# Altium schematic sheet Uav_V1.SchDoc: UAV Kommunikation PCB
size A3; DrawnBy: Andreas Albisser; Organization: HSLU T&A; Address1: Abteilung Elektrotechnik; Address2: Technikumsstrasse 21; Address3: CH-6048 Horw; Revision: 1; SheetNumber: 1; SheetTotal: 1; Projektname: UAV Inspektion; PageSetup: Record=PageOptions|CenterHorizontal=True|CenterVertical=True|PrintScale=0.73|XCorrection=1.00|YCorrection=1.00|PrintKind=0|BorderSize=5000000|LeftOffset=0|BottomOffset=0|Orientation=2|PaperLength=1000|PaperWidth=1000|Scale=100|PaperSource=7|PrintQuality=-3|MediaType=1|DitherType=10|PrintScaleMode=1|PaperKind=A4|PaperIndex=9
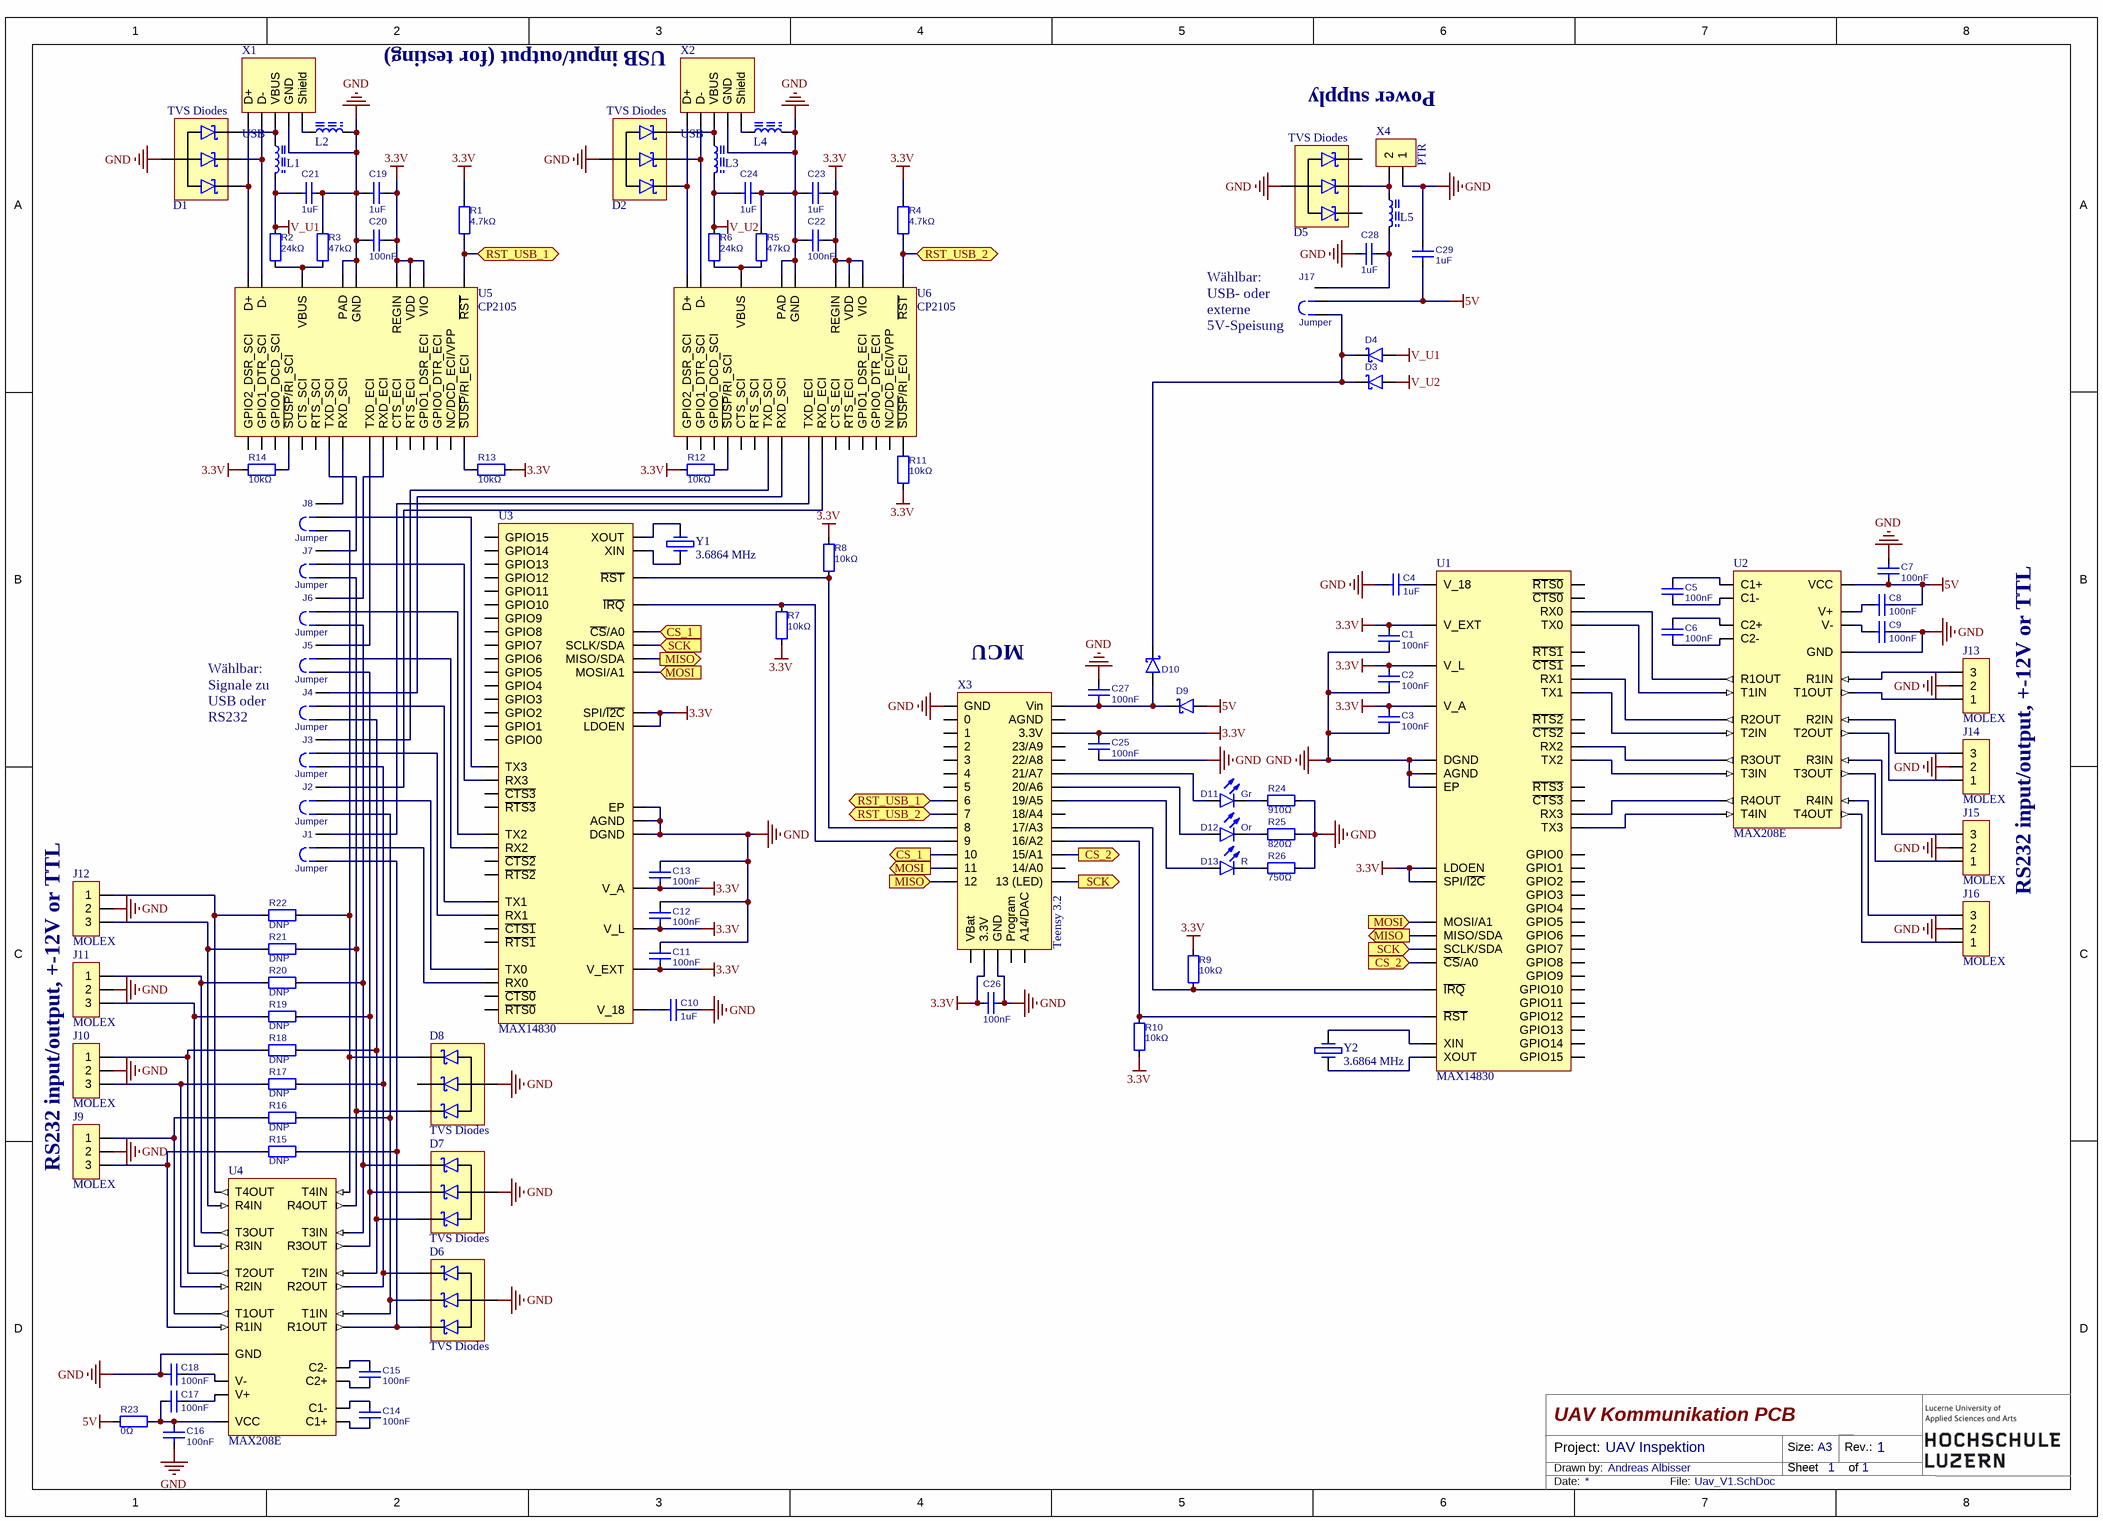
[diagram p0: Uav_V1.SchDoc]

## Parts
C1  100nF  [0603]
C2  100nF  [0603]
C3  100nF  [0603]
C4  1uF  [0603]
C5  100nF  [0603]
C6  100nF  [0603]
C7  100nF  [0603]
C8  100nF  [0603]
C9  100nF  [0603]
C10  1uF  [0603]
C11  100nF  [0603]
C12  100nF  [0603]
C13  100nF  [0603]
C14  100nF  [0603]
C15  100nF  [0603]
C16  100nF  [0603]
C17  100nF  [0603]
C18  100nF  [0603]
C19  1uF  [0603]
C20  100nF  [0603]
C21  1uF  [0603]
C22  100nF  [0603]
C23  1uF  [0603]
C24  1uF  [0603]
C25  100nF  [0603]
C26  100nF  [0603]
C27  100nF  [0603]
C28  1uF  [0603]
C29  1uF  [0603]
D1  TVS Diodes  [SOT-143-4]
D2  TVS Diodes  [SOT-143-4]
D3  ?  [SOD-123]  (value not drawn)
D4  ?  [SOD-123]  (value not drawn)
D5  TVS Diodes  [SOT-143-4]
D6  TVS Diodes  [SOT-143-4]
D7  TVS Diodes  [SOT-143-4]
D8  TVS Diodes  [SOT-143-4]
D9  ?  [SOD-123]  (value not drawn)
D10  ?  [SOD-123]  (value not drawn)
D11  Gr  [0603D]
D12  Or  [0603D]
D13  R  [0603D]
J1  Jumper  [Header2,54mm_1x3]
J2  Jumper  [Header2,54mm_1x3]
J3  Jumper  [Header2,54mm_1x3]
J4  Jumper  [Header2,54mm_1x3]
J5  Jumper  [Header2,54mm_1x3]
J6  Jumper  [Header2,54mm_1x3]
J7  Jumper  [Header2,54mm_1x3]
J8  Jumper  [Header2,54mm_1x3]
J9  MOLEX  [MOLEX_1x3]
J10  MOLEX  [MOLEX_1x3]
J11  MOLEX  [MOLEX_1x3]
J12  MOLEX  [MOLEX_1x3]
J13  MOLEX  [MOLEX_1x3]
J14  MOLEX  [MOLEX_1x3]
J15  MOLEX  [MOLEX_1x3]
J16  MOLEX  [MOLEX_1x3]
J17  Jumper  [Header2,54mm_1x3]
L1  MPZ1608S601A  [0603]  (value not drawn)
L2  MPZ1608S601A  [0603]  (value not drawn)
L3  MPZ1608S601A  [0603]  (value not drawn)
L4  MPZ1608S601A  [0603]  (value not drawn)
L5  MPZ1608S601A  [0603]  (value not drawn)
R1  4.7kΩ  [0603]
R2  24kΩ  [0603]
R3  47kΩ  [0603]
R4  4.7kΩ  [0603]
R5  47kΩ  [0603]
R6  24kΩ  [0603]
R7  10kΩ  [0603]
R8  10kΩ  [0603]
R9  10kΩ  [0603]
R10  10kΩ  [0603]
R11  10kΩ  [0603]
R12  10kΩ  [0603]
R13  10kΩ  [0603]
R14  10kΩ  [0603]
R15  DNP  [0603]
R16  DNP  [0603]
R17  DNP  [0603]
R18  DNP  [0603]
R19  DNP  [0603]
R20  DNP  [0603]
R21  DNP  [0603]
R22  DNP  [0603]
R23  0Ω  [0603]
R24  910Ω  [0603]
R25  820Ω  [0603]
R26  750Ω  [0603]
U1  MAX14830  [TQFN48]
U2  MAX208E  [SSOP24]
U3  MAX14830  [TQFN48]
U4  MAX208E  [SSOP24]
U5  CP2105  [QFN24]
U6  CP2105  [QFN24]
X1  USB  [USB_Mini_TypB]
X2  USB  [USB_Mini_TypB]
X3  Teensy 3.2  [Teensy_3_2]
X4  PTR  [PTR_1X2]
Y1  3.6864 MHz  [Crystal_10x4_5mm]
Y2  3.6864 MHz  [Crystal_10x4_5mm]

## Ports
CS_1 (in), CS_1 (out), CS_2 (in), CS_2 (out), MISO (in), MISO (out), MOSI (in), MOSI (out), RST_USB_1, RST_USB_2, SCK (in), SCK (out)

## Nets
3.3V: C1.2 C2.2 C3.2 C11.2 C12.2 C13.2 C19.1 C20.1 C22.1 C23.1 C25.1 C26.1 R1.2 R4.2 R7.1 R8.2 R9.2 R10.1 R11.1 R12.2 R13.1 R14.2 U1.1(SPI/~{I2C}) U1.2(LDOEN) U1.9(V_L) U1.43(V_EXT) U1.47(V_A) U3.1(SPI/~{I2C}) U3.2(LDOEN) U3.9(V_L) U3.43(V_EXT) U3.47(V_A) U5.5(VIO) U5.6(VDD) U5.7(REGIN) U6.5(VIO) U6.6(VDD) U6.7(REGIN) X3.3.3V_1(3.3V) X3.3.3V_2(3.3V)
5V: C7.1 C8.1 C29.1 D9.1(A) J17.2 R23.2 U2.9(VCC)
GND: C1.1 C2.1 C3.1 C4.1 C7.2 C9.1 C10.1 C11.1 C12.1 C13.1 C16.2 C18.1 C19.2 C20.2 C21.1 C22.2 C23.2 C24.1 C25.2 C26.2 C27.1 C28.2 C29.2 D1.1(CA) D2.1(CA) D5.1(CA) D6.1(CA) D7.1(CA) D8.1(CA) J9.2 J10.2 J11.2 J12.2 J13.2 J14.2 J15.2 J16.2 L2.2 L4.2 R3.1 R5.1 R24.1 R25.1 R26.1 U1.10(DGND) U1.46(AGND) U1.49(EP) U2.8(GND) U3.10(DGND) U3.46(AGND) U3.49(EP) U4.8(GND) U5.2(GND) U5.25(PAD) U6.2(GND) U6.25(PAD) X1.4(GND) X2.4(GND) X3.GND_1(GND) X3.GND_2(GND) X4.1
V_U1: C21.2 D4.1(A) L1.2 R2.1
V_U2: C24.2 D3.1(A) L3.2 R6.1
CS_1: U3.5(~{CS}/A0) X3.10 ; port CS_1
CS_2: U1.5(~{CS}/A0) X3.15(15/A1) ; port CS_2
MISO: U1.3(MISO/SDA) U3.3(MISO/SDA) X3.12 ; port MISO
MOSI: U1.6(MOSI/A1) U3.6(MOSI/A1) X3.11 ; port MOSI
RST_USB_1: R1.1 U5.9(~{RST}) X3.6 ; port RST_USB_1
RST_USB_2: R4.1 U6.9(~{RST}) X3.7 ; port RST_USB_2
SCK: U1.4(SCLK/SDA) U3.4(SCLK/SDA) X3.13(13_(LED)) ; port SCK
NetC4_2: C4.2 U1.48(V_18)
NetC5_1: C5.1 U2.12(C1-)
NetC5_2: C5.2 U2.10(C1+)
NetC6_1: C6.1 U2.14(C2-)
NetC6_2: C6.2 U2.13(C2+)
NetC8_2: C8.2 U2.11(V+)
NetC9_2: C9.2 U2.15(V-)
NetC10_2: C10.2 U3.48(V_18)
NetC14_1: C14.1 U4.12(C1-)
NetC14_2: C14.2 U4.10(C1+)
NetC15_1: C15.1 U4.14(C2-)
NetC15_2: C15.2 U4.13(C2+)
NetC16_1: C16.1 C17.1 R23.1 U4.9(VCC)
NetC17_2: C17.2 U4.11(V+)
NetC18_2: C18.2 U4.15(V-)
NetC27_2: C27.2 D9.2(K) D10.1(A) X3.Vin
NetC28_1: C28.1 J17.3 L5.2
NetD1_2: D1.2(K1) U5.3(D+) X1.3(D+)
NetD1_3: D1.3(K2) U5.4(D-) X1.2(D-)
NetD1_4: D1.4(K3) L1.1 X1.1(VBUS)
NetD2_2: D2.2(K1) U6.3(D+) X2.3(D+)
NetD2_3: D2.3(K2) U6.4(D-) X2.2(D-)
NetD2_4: D2.4(K3) L3.1 X2.1(VBUS)
NetD3_2: D3.2(K) D4.2(K) D10.2(K) J17.1
NetD5_3: D5.3(K2) L5.1 X4.2
NetD6_2: D6.2(K1) J3.1 R17.1 U4.4(R2OUT)
NetD6_3: D6.3(K2) J2.1 R16.1 U4.5(T1IN)
NetD6_4: D6.4(K3) J1.1 R15.1 U4.6(R1OUT)
NetD7_2: D7.2(K1) J6.1 R20.1 U4.19(T3IN)
NetD7_3: D7.3(K2) J5.1 R19.1 U4.22(R3OUT)
NetD7_4: D7.4(K3) J4.1 R18.1 U4.18(T2IN)
NetD8_2: D8.2(K1) J8.1 R22.1 U4.21(T4IN)
NetD8_4: D8.4(K3) J7.1 R21.1 U4.17(R4OUT)
NetD11_1: D11.1(A) X3.21(21/A7)
NetD11_2: D11.2(K) R24.2
NetD12_1: D12.1(A) X3.20(20/A6)
NetD12_2: D12.2(K) R25.2
NetD13_1: D13.1(A) X3.19(19/A5)
NetD13_2: D13.2(K) R26.2
NetJ1_2: J1.2 U3.17(RX0)
NetJ1_3: J1.3 U6.13(TXD_ECI)
NetJ2_2: J2.2 U3.18(TX0)
NetJ2_3: J2.3 U6.12(RXD_ECI)
NetJ3_2: J3.2 U3.25(RX1)
NetJ3_3: J3.3 U6.21(TXD_SCI)
NetJ4_2: J4.2 U3.26(TX1)
NetJ4_3: J4.3 U6.20(RXD_SCI)
NetJ5_2: J5.2 U3.33(RX2)
NetJ5_3: J5.3 U5.13(TXD_ECI)
NetJ6_2: J6.2 U3.34(TX2)
NetJ6_3: J6.3 U5.12(RXD_ECI)
NetJ7_2: J7.2 U3.41(RX3)
NetJ7_3: J7.3 U5.21(TXD_SCI)
NetJ8_2: J8.2 U3.42(TX3)
NetJ8_3: J8.3 U5.20(RXD_SCI)
NetJ9_1: J9.1 R16.2 U4.2(T1OUT)
NetJ9_3: J9.3 R15.2 U4.7(R1IN)
NetJ10_1: J10.1 R18.2 U4.1(T2OUT)
NetJ10_3: J10.3 R17.2 U4.3(R2IN)
NetJ11_1: J11.1 R20.2 U4.24(T3OUT)
NetJ11_3: J11.3 R19.2 U4.23(R3IN)
NetJ12_1: J12.1 R22.2 U4.20(T4OUT)
NetJ12_3: J12.3 R21.2 U4.16(R4IN)
NetJ13_1: J13.1 U2.2(T1OUT)
NetJ13_3: J13.3 U2.7(R1IN)
NetJ14_1: J14.1 U2.1(T2OUT)
NetJ14_3: J14.3 U2.3(R2IN)
NetJ15_1: J15.1 U2.24(T3OUT)
NetJ15_3: J15.3 U2.23(R3IN)
NetJ16_1: J16.1 U2.20(T4OUT)
NetJ16_3: J16.3 U2.16(R4IN)
NetL2_1: L2.1 X1.0(Shield)
NetL4_1: L4.1 X2.0(Shield)
NetR2_2: R2.2 R3.2 U5.8(VBUS)
NetR5_2: R5.2 R6.2 U6.8(VBUS)
NetR7_2: R7.2 U3.7(~{IRQ}) X3.9
NetR8_1: R8.1 U3.8(~{RST}) X3.8
NetR9_1: R9.1 U1.7(~{IRQ}) X3.17(17/A3)
NetR10_2: R10.2 U1.8(~{RST}) X3.16(16/A2)
NetR11_2: R11.2 U6.17(~{SUSP}/RI_ECI)
NetR12_1: R12.1 U6.1(~{SUSP}/RI_SCI)
NetR13_2: R13.2 U5.17(~{SUSP}/RI_ECI)
NetR14_1: R14.1 U5.1(~{SUSP}/RI_SCI)
NetU1_17: U1.17(RX0) U2.6(R1OUT)
NetU1_18: U1.18(TX0) U2.5(T1IN)
NetU1_25: U1.25(RX1) U2.4(R2OUT)
NetU1_26: U1.26(TX1) U2.18(T2IN)
NetU1_33: U1.33(RX2) U2.22(R3OUT)
NetU1_34: U1.34(TX2) U2.19(T3IN)
NetU1_41: U1.41(RX3) U2.17(R4OUT)
NetU1_42: U1.42(TX3) U2.21(T4IN)
NetU1_44: U1.44(XOUT) Y2.1
NetU1_45: U1.45(XIN) Y2.2
NetU3_44: U3.44(XOUT) Y1.2
NetU3_45: U3.45(XIN) Y1.1

Not connected (* = marked no-connect by the designer): D5 2(K1) 4(K3); D8 3(K2); U1 11(GPIO0) 12(GPIO1) 13(GPIO2) 14(GPIO3) 15(~{RTS0}) 16(~{CTS0}) 19(GPIO4) 20(GPIO5) 21(GPIO6) 22(GPIO7) 23(~{RTS1}) 24(~{CTS1}) 27(GPIO8) 28(GPIO9) 29(GPIO10) 30(GPIO11) 31(~{RTS2}) 32(~{CTS2}) 35(GPIO12) 36(GPIO13) 37(GPIO14) 38(GPIO15) 39(~{RTS3}) 40(~{CTS3}); U3 11(GPIO0) 12(GPIO1) 13(GPIO2) 14(GPIO3) 15(~{RTS0}) 16(~{CTS0}) 19(GPIO4) 20(GPIO5) 21(GPIO6) 22(GPIO7) 23(~{RTS1}) 24(~{CTS1}) 27(GPIO8) 28(GPIO9) 29(GPIO10) 30(GPIO11) 31(~{RTS2}) 32(~{CTS2}) 35(GPIO12) 36(GPIO13) 37(GPIO14) 38(GPIO15) 39(~{RTS3}) 40(~{CTS3}); U5 10(CTS_ECI) 11(RTS_ECI) 14(GPIO1_DSR_ECI) 15(GPIO0_DTR_ECI) 16(NC/DCD_ECI/VPP) 18(CTS_SCI) 19(RTS_SCI) 22(GPIO2_DSR_SCI) 23(GPIO1_DTR_SCI) 24(GPIO0_DCD_SCI); U6 10(CTS_ECI) 11(RTS_ECI) 14(GPIO1_DSR_ECI) 15(GPIO0_DTR_ECI) 16(NC/DCD_ECI/VPP) 18(CTS_SCI) 19(RTS_SCI) 22(GPIO2_DSR_SCI) 23(GPIO1_DTR_SCI) 24(GPIO0_DCD_SCI); X3 0 1 2 3 4 5 14(14/A0) 18(18/A4) 22(22/A8) 23(23/A9) A14(A14/DAC) AGND Program VBat

## Notes on the sheet
- USB input/output (for testing)
- Power supply
- (near J17) Wählbar: USB- oder externe 5V-Speisung
- (near X3) MCU
- Wählbar: Signale zu USB oder RS232
- RS232 input/output, +-12V or TTL
- Project:
- Drawn by:
- Size:
- Sheet
- A3
- Rev.:
- of
- Date:
- File:

## Library data of the parts
C1-C29 = 4: Keramikkondensator 0603; Changed by: taalbiss; Number of pads: 2; Part ID: 4; Category: Capacitors - Ceramic; Distributor: Mouser; Distributor Order Number: 0; ComponentLink1URL: http://www.mouser.ch/Passive-Components/Capacitors/Ceramic-Capacitors/MLCCs-Multilayer-Ceramic-Capacitors/Multilayer-Ceramic-Capacitors-MLCC-SMD-SMT/_/N-bkrdv?P=1yzmou6; ComponentLink1Description: Mouser 0603 Ceramic Capacitors; Price: 0; Changed at: 21.07.2015 17:44:32; SMD: True
D1 D2 D5-D8 = TVS_Diode_3fach: Distributor Order Number: 576-SP0503BAHTG; Distributor: Mouser
D3 D4 D9 D10 = 49: Schottky Diode SOD-123; Changed by: taalbiss; Number of pads: 2; Part ID: 49; Category: Diodes; Distributor: Mouser; Distributor Order Number: 863-MBR0520LT1G; ComponentLink1URL: http://www.mouser.ch/Semiconductors/Discrete-Semiconductors/Diodes-Rectifiers/Schottky-Diodes-Rectifiers/_/N-ax1mj?P=1z0yr4v; ComponentLink1Description: Mouser SOD-123 Schottky Diodes; Price: 0; Changed at: 04.08.2015 09:41:59; SMD: True
D11-D13 = 109: LED SMD 0603; Changed by: taalbiss; Number of pads: 2; Part ID: 109; Category: Optical; Distributor: Mouser; ComponentLink1URL: http://www.mouser.ch/Optoelectronics/LED-Lighting/LED-Emitters/Standard-LEDs-SMD/_/N-b1bb1?P=1yzvlv6Z1yzvlkx; ComponentLink1Description: Mouser 0603 LED's; Price: 0; Changed at: 28.08.2015 11:09:55; SMD: True
  D11: Distributor Order Number: 720-LGL29KG2J124Z
  D12: Distributor Order Number: 720-LOL29KH2L124Z
  D13: Distributor Order Number: 720-LSL296-N2Q1-1-Z
J1-J8 J17 = 107: Jumper THT 2.54mm 1x3; Changed by: taalbiss; Number of pads: 3; Part ID: 107; Category: Connectors; Distributor: ?; Distributor Order Number: 0; Price: 0; Changed at: 26.08.2015 10:33:14; SMD: False
J9-J16 = Header_1x3: Distributor: Mouser; Distributor Order Number: 538-90136-1103
L1-L5 = 45: Ferrit 0603; Changed by: taalbiss; Number of pads: 2; Part ID: 45; Category: Ferrites; Distributor: Mouser; Distributor Order Number: 810-MPZ1608S601A; ComponentLink1URL: http://www.mouser.ch/Passive-Components/EMI-RFI-Components/EMI-Filter-Beads-Chips-Arrays/_/N-bw7pa?P=1yzvlkx; ComponentLink1Description: Mouser 0603 Ferrites; Price: 0; Changed at: 03.08.2015 14:45:01; SMD: True
R1-R26 = 2: Widerstand 0603; Changed by: taalbiss; Number of pads: 2; Part ID: 2; Category: Resistors; Distributor: Mouser; ComponentLink1URL: http://www.mouser.ch/Passive-Components/Resistors/SMD-Resistors-Chip-Resistors/_/N-7h7yu?P=1yzmou6; ComponentLink1Description: Mouser 0603 Resistors; Price: 0; Changed at: 21.07.2015 17:44:48; SMD: True
  R1 R4: Distributor Order Number: 660-RK73H1JTTD4701F
  R2 R6: Distributor Order Number: 71-CRCW0603-24K-E3
  R3 R5: Distributor Order Number: 755-KTR03EZPF4702
  R7-R14: Distributor Order Number: 71-CRCW0603-10K-E3
  R15-R26: Distributor Order Number: 0
X3 = Teensy_3_2: Distributor Order Number: 474-DEV-13736; Distributor: Mouser; ComponentLink1Description: Teensy 3.2 @ sparkfun; ComponentLink1URL: https://www.sparkfun.com/products/13736
X4 = Header_1x2: Distributor Order Number: 148-41-250; Distributor: Distrelec
Y1 Y2 = Crystal_3_6864_MHz: Distributor Order Number: 559-FQ1045AR-3.6864; Distributor: Mouser
U1 U3 = MAX14830: Distributor Order Number: 700-MAX14830ETM+; Distributor: Mouser
U2 U4 = MAX208E: Distributor Order Number: 700-MAX208ECAG; Distributor: Mouser
U5 U6 = CP2105: Distributor Order Number: 634-CP2105-F01-GM; Distributor: Mouser
X1 X2 = USB: Distributor Order Number: 798-UX60SC-MB-5ST; Distributor: Mouser